# Altium schematic sheet AT_Link_V1.4.SchDoc
size A4
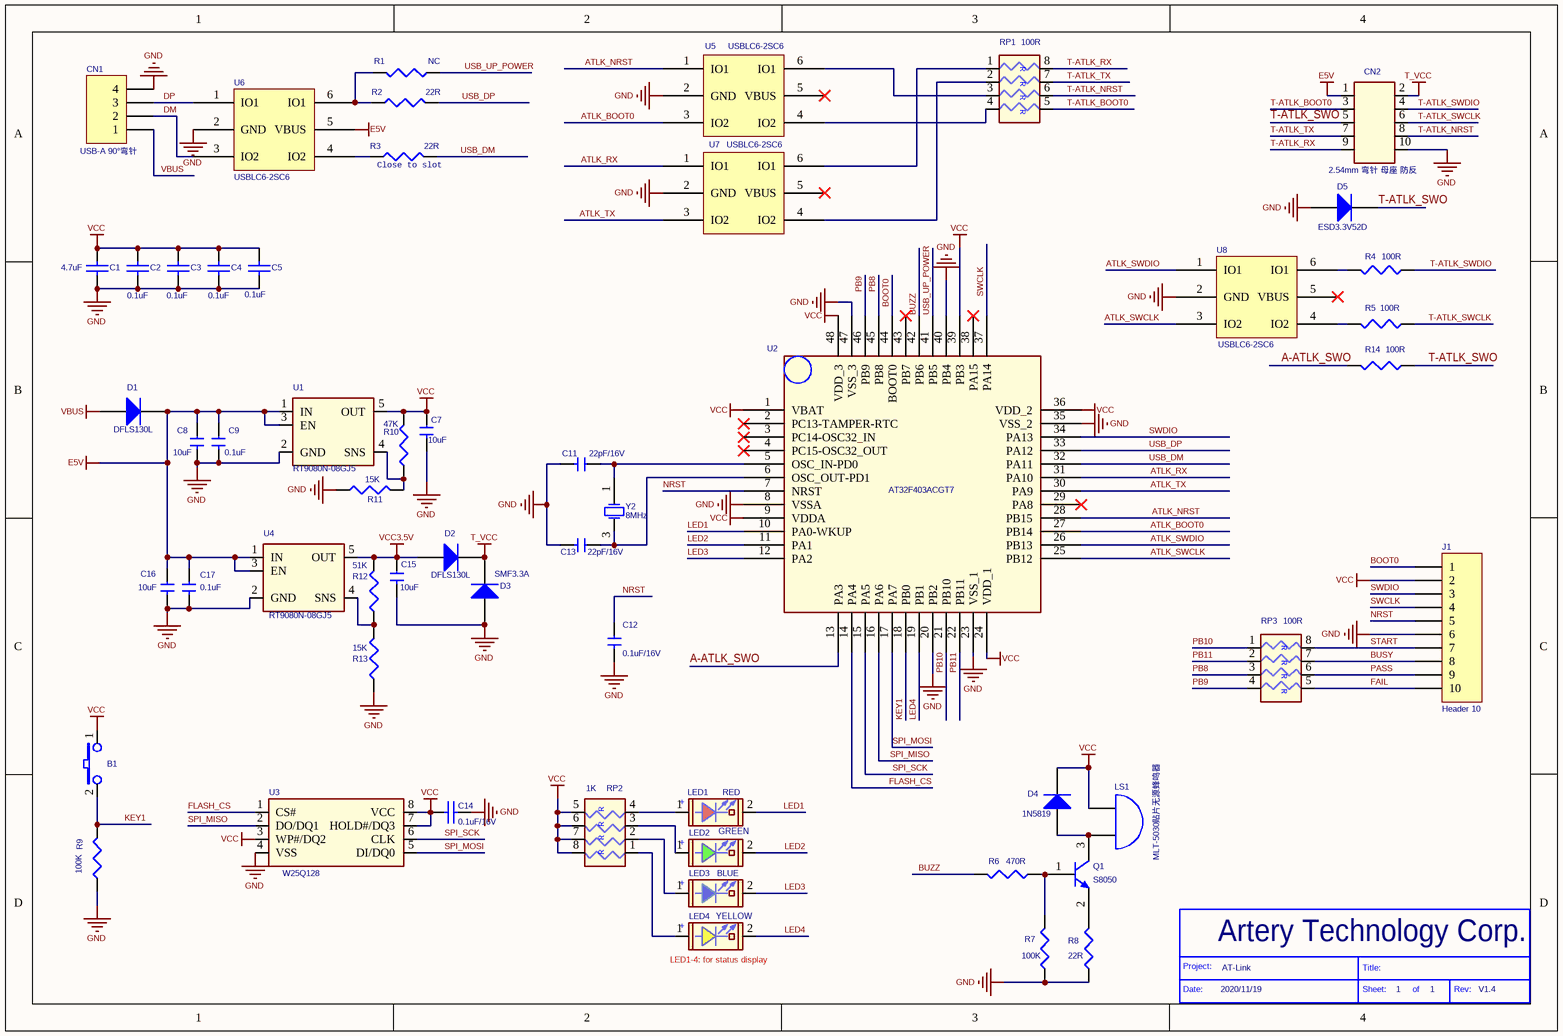
[diagram p0: AT_Link_V1.4.SchDoc]

## Parts
B1  PB,Blue,SMD_2P  [KEY_3*6*2.5]  (value not drawn)
C1  4.7uF  [C0603]
C2  0.1uF  [C0603]
C3  0.1uF  [C0603]
C4  0.1uF  [C0603]
C5  0.1uF  [C0603]
C7  10uF  [C0603]
C8  10uF  [C0603]
C9  0.1uF  [C0603]
C11  22pF/16V  [C0603]
C12  0.1uF/16V  [C0603]
C13  22pF/16V  [C0603]
C14  0.1uF/16V  [C0603]
C15  10uF  [C0603]
C16  10uF  [C0603]
C17  0.1uF  [C0603]
CN1  USB-A 90°弯针  [USB_A - Dip]
CN2  CON1  [SWD_2*5P_SMT]  (value not drawn)
D1  DFLS130L  [SOD-123]
D2  DFLS130L  [SOD-123]
D3  SMF3.3A  [SOD-123]
D4  1N5819  [LED0603]
D5  ESD3.3V52D  [SOD523]
J1  Header 10  [HDR1X10]
LED1  RED  [LED0603]
LED2  GREEN  [LED0603]
LED3  BLUE  [LED0603]
LED4  YELLOW  [LED0603]
LS1  MLT-5030贴片无源蜂鸣器  [BUZZER - 5030]
Q1  S8050  [SOT-23]
R1  NC  [R0603]
R2  22R  [R0603]
R3  22R  [R0603]
R4  100R  [R0603]
R5  100R  [R0603]
R6  470R  [R0603]
R7  100K  [R0603]
R8  22R  [R0603]
R9  100K  [R0603]
R10  47K  [R0603]
R11  15K  [R0603]
R12  51K  [R0603]
R13  15K  [R0603]
R14  100R  [R0603]
RP1  100R  [RP_4-0603]
RP2  1K  [RP_4-0603]
RP3  100R  [RP_4-0603]
U1  RT9080N-08GJ5  [SOT-23-5]
U2  AT32F403ACGT7  [LQFP48 - 2]
U3  W25Q128  [SOIC8_208]
U4  RT9080N-08GJ5  [SOT-23-5]
U5  USBLC6-2SC6  [SOT23_6P - L]
U6  USBLC6-2SC6  [SOT23_6P - L]
U7  USBLC6-2SC6  [SOT23_6P - L]
U8  USBLC6-2SC6  [SOT23_6P - L]
Y2  8MHz  [XTAL_5032]

## Nets
E5V: C8.1 C9.1 C16.1 C17.1 CN2.1 D1.2(K) U1.1(IN) U1.3(EN) U4.1(IN) U4.3(EN) U6.5(VBUS)
GND: C1.1 C2.1 C3.1 C4.1 C5.1 C7.2 C8.2 C9.2 C11.2 C12.2 C13.2 C14.1 C15.2 C16.2 C17.2 CN1.4 CN2.10 D3.1(A) D5.1(A) J1.6 R7.1 R8.1 R9.1 R11.1 R13.1 U1.2(GND) U2.8(VSSA) U2.20(PB2) U2.23(VSS_1) U2.35(VSS_2) U2.40(PB4) U2.47(VSS_3) U3.4(VSS) U4.2(GND) U5.2(GND) U6.2(GND) U7.2(GND) U8.2(GND)
T_VCC: CN2.2 D2.2(K) D3.2(K)
VBUS: CN1.1 D1.1(A)
VCC: B1.1 C1.2 C2.2 C3.2 C4.2 C5.2 C7.1 C14.2 D4.2(K) J1.2 LS1.1(A) R10.2 RP2.5 RP2.6 RP2.7 RP2.8 U1.5(OUT) U2.1(VBAT) U2.9(VDDA) U2.24(VDD_1) U2.36(VDD_2) U2.39(PB3) U2.48(VDD_3) U3.3(WP#/DQ2) U3.7(HOLD#/DQ3) U3.8(VCC)
VCC3.5V: C15.1 D2.1(A) R12.2 U4.5(OUT)
A-ATLK_SWO: R14.2 U2.13(PA3)
ATLK_BOOT0: U2.27(PB14) U5.3(IO2)
ATLK_NRST: U2.28(PB15) U5.1(IO1)
ATLK_RX: U2.31(PA10) U7.1(IO1)
ATLK_SWCLK: U2.25(PB12) U8.3(IO2)
ATLK_SWDIO: U2.26(PB13) U8.1(IO1)
ATLK_TX: U2.30(PA9) U7.3(IO2)
BOOT0: J1.1 U2.44(BOOT0)
BUSY: J1.8 RP3.7
BUZZ: R6.2 U2.42(PB6)
DM: CN1.2 U6.3(IO2)
DP: CN1.3 U6.1(IO1)
FAIL: J1.10 RP3.5
FLASH_CS: U2.14(PA4) U3.1(CS#)
KEY1: B1.2 R9.2 U2.18(PB0)
LED1: LED1.2(CATHODE) U2.10(PA0-WKUP)
LED2: LED2.2(CATHODE) U2.11(PA1)
LED3: LED3.2(CATHODE) U2.12(PA2)
LED4: LED4.2(CATHODE) U2.19(PB1)
NRST: C12.1 J1.5 U2.7(NRST)
PASS: J1.9 RP3.6
PB8: RP3.3 U2.45(PB8)
PB9: RP3.4 U2.46(PB9)
PB10: RP3.1 U2.21(PB10)
PB11: RP3.2 U2.22(PB11)
SPI_MISO: U2.16(PA6) U3.2(DO/DQ1)
SPI_MOSI: U2.17(PA7) U3.5(DI/DQ0)
SPI_SCK: U2.15(PA5) U3.6(CLK)
START: J1.7 RP3.8
SWCLK: J1.4 U2.37(PA14)
SWDIO: J1.3 U2.34(PA13)
T-ATLK_BOOT0: CN2.3 RP1.5
T-ATLK_NRST: CN2.8 RP1.6
T-ATLK_RX: CN2.9 RP1.8
T-ATLK_SWCLK: CN2.6 R5.1
T-ATLK_SWDIO: CN2.4 R4.1
T-ATLK_SWO: CN2.5 D5.2(K) R14.1
T-ATLK_TX: CN2.7 RP1.7
USB_DM: R3.2 U2.32(PA11)
USB_DP: R2.2 U2.33(PA12)
USB_UP_POWER: R1.1 U2.41(PB5)
NetC11_1: C11.1 U2.5(OSC_IN-PD0) Y2.1(OSC1)
NetC13_1: C13.1 U2.6(OSC_OUT-PD1) Y2.3(OSC2)
NetD4_1: D4.1(A) LS1.2(B) Q1.3(C)
NetLED1_1: LED1.1(ANODE) RP2.4
NetLED2_1: LED2.1(ANODE) RP2.3
NetLED3_1: LED3.1(ANODE) RP2.2
NetLED4_1: LED4.1(ANODE) RP2.1
NetQ1_1: Q1.1(B) R6.1 R7.2
NetQ1_2: Q1.2(E) R8.2
NetR1_2: R1.2 R2.1 U6.6(IO1)
NetR3_1: R3.1 U6.4(IO2)
NetR4_2: R4.2 U8.6(IO1)
NetR5_2: R5.2 U8.4(IO2)
NetR10_1: R10.1 R11.2 U1.4(SNS)
NetR12_1: R12.1 R13.2 U4.4(SNS)
NetRP1_1: RP1.1 U7.6(IO1)
NetRP1_2: RP1.2 U7.4(IO2)
NetRP1_3: RP1.3 U5.6(IO1)
NetRP1_4: RP1.4 U5.4(IO2)

Not connected (* = marked no-connect by the designer): U2 2(PC13-TAMPER-RTC)* 3(PC14-OSC32_IN)* 4(PC15-OSC32_OUT)* 29(PA8)* 38(PA15)* 43(PB7)*; U5 5(VBUS)*; U7 5(VBUS)*; U8 5(VBUS)*

## Notes on the sheet
- (near R3) Close to slot
- (near CN2) 2.54mm 弯针 母座 防反
- (near LED4) LED1-4: for status display
- 2020/11/19
- AT-Link
- 1
- V1.4
- Project:
- Date:
- Artery Technology Corp.
- Title:
- Sheet:
- of
- Rev:
- (in symbol 22,1/16W,5%,8P4R) R
- (in symbol BLUE,SMD0603) +
- (in symbol GREEN,SMD0603) +
- (in symbol RED,SMD0603) +
- (in symbol YELLOW,SMD0603) +

## Library data of the parts
B1 = Push_Bottom,Blue,SMD_2P: 3*6*5
C1-C5 = Cap Semi: Capacitor (Semiconductor SIM Model); Published: 8-Jun-2000; LatestRevisionDate: 29-May-2009; LatestRevisionNote: IPC-7351 Footprint Added.; PackageReference: C1206; Publisher: Altium Limited; PackageDescription: Chip Capacitor
  C1: Value: 4.7uf
  C2-C5: Value: 0.1uf
C7-C9 C12 C15-C17 = 0.1uF,50V,20%,SMD0603
C11 C13 = 10pF,50V,5%,SMD0603
C14 = Cap Semi: Capacitor (Semiconductor SIM Model); Value: 0.1uf; Published: 8-Jun-2000; LatestRevisionDate: 29-May-2009; LatestRevisionNote: IPC-7351 Footprint Added.; PackageReference: C1206; Publisher: Altium Limited; PackageDescription: Chip Capacitor
CN1 = Header 4: Header, 4-Pin; LatestRevisionDate: 17-Jul-2002; LatestRevisionNote: Re-released for DXP Platform.; Publisher: Altium Limited
CN2 = CON10A_0
D1-D5 = Diode: Default Diode; Published: 8-Jun-2000; LatestRevisionDate: 17-Jul-2002; LatestRevisionNote: Re-released for DXP Platform.; PackageVersion: Sep-1996; PackageReference: SMC; Publisher: Altium Limited; PackageDescription: DO-214-AB/SMC; 2 C-Bend Leads; Body 7.9 x 5.9 mm, inc. leads (LxW); Code_JEDEC: DO-214-AB
J1 = Header 10: Header, 10-Pin; LatestRevisionDate: 17-Jul-2002; LatestRevisionNote: Re-released for DXP Platform.; Publisher: Altium Limited
LED1 = RED,SMD0603
LED2 = GREEN,SMD0603
LED3 = BLUE,SMD0603: 贴片LED 蓝色 0603
LED4 = YELLOW,SMD0603
LS1 = Bell: Electrical Bell; Published: 24-Mar-1999; LatestRevisionDate: 17-Jul-2002; LatestRevisionNote: Re-released for DXP Platform.; PackageReference: PIN2; Publisher: Altium Limited
Q1 = NPN
R1 = 10K,1/10W,1%,SMD0603_Dup1
R2-R5 R14 = 22,1/10W,1%,SMD0603
R6-R8 R10-R13 = 470,1/10W,1%,SMD0603
R9 = 10K,1/10W,1%,SMD0603
RP1-RP3 = 22,1/16W,5%,8P4R
U1 U4 = RT9080N
U2 = LQFP48&QFN48
U3 = W25Q128FVSIQ,SOIC8_1
Y2 = SMD-5032_4P  8MHZ 20PF 10PPM: 贴片晶振; ComponentLink1Description: 供应商链接; ComponentLink1URL: http://www.szlcsc.com/product/details_9522.html; Package: SMD-3225_4P; Supplier: LC; SuppliersPartNumber: C9002